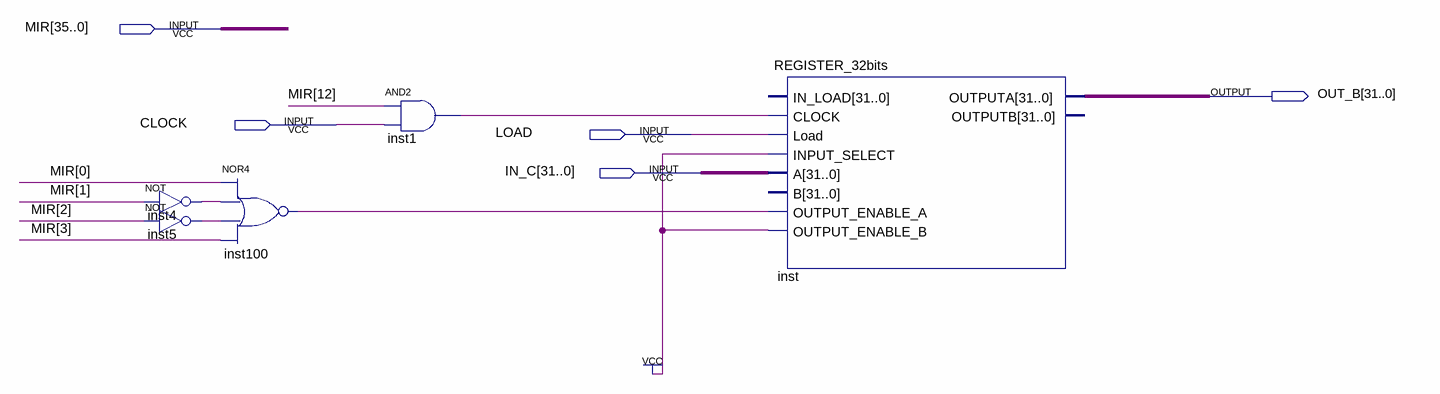
[diagram p0: schematic sheet]
// Quartus schematic CPP.bdf as structural Verilog: 5 symbols, 5 pins
module CPP (
  input  [35:0] MIR,
  input  CLOCK,
  input  LOAD,
  input  [31:0] IN_C,
  output [31:0] OUT_B
);

  wire inst1_out, inst4_out, inst5_out, inst100_out;

  not inst4 (inst4_out, MIR[1]);
  not inst5 (inst5_out, MIR[2]);
  nor inst100 (inst100_out, MIR[0], inst4_out, inst5_out, MIR[3]);
  and inst1 (inst1_out, MIR[12], CLOCK);
  REGISTER_32bits inst (
    .CLOCK(inst1_out), .Load(LOAD), .INPUT_SELECT(1'b1), .A(IN_C), .OUTPUT_ENABLE_A(inst100_out),
    .OUTPUT_ENABLE_B(1'b1), .OUTPUTA(OUT_B));  // open: IN_LOAD, B, OUTPUTB
endmodule
